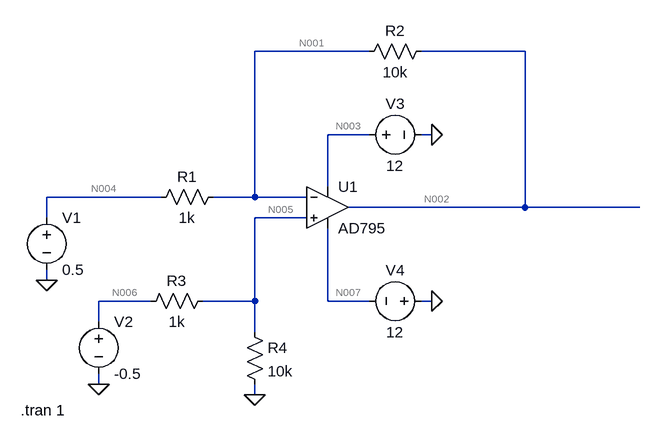
[diagram p0: schematic t1.asc]
t1.asc, the LTspice schematic file:
Version 4.1
SHEET 1 1064 680
WIRE 576 80 400 80
WIRE 816 80 656 80
WIRE 576 208 512 208
WIRE 672 208 656 208
WIRE 512 288 512 208
WIRE 256 304 80 304
WIRE 400 304 400 80
WIRE 400 304 336 304
WIRE 480 304 400 304
WIRE 816 320 816 80
WIRE 816 320 544 320
WIRE 992 320 816 320
WIRE 80 336 80 304
WIRE 480 336 400 336
WIRE 80 432 80 416
WIRE 240 464 160 464
WIRE 400 464 400 336
WIRE 400 464 320 464
WIRE 512 464 512 352
WIRE 576 464 512 464
WIRE 672 464 656 464
WIRE 160 496 160 464
WIRE 400 512 400 464
WIRE 160 592 160 576
WIRE 400 608 400 592
FLAG 80 432 0
FLAG 160 592 0
FLAG 400 608 0
FLAG 672 208 0
FLAG 672 464 0
DATAFLAG 912 320 ""
SYMBOL OpAmps\\AD795 512 256 R0
SYMATTR InstName U1
SYMBOL res 352 288 R90
WINDOW 0 0 56 VBottom 2
WINDOW 3 32 56 VTop 2
SYMATTR InstName R1
SYMATTR Value 1k
SYMBOL res 672 64 R90
WINDOW 0 0 56 VBottom 2
WINDOW 3 32 56 VTop 2
SYMATTR InstName R2
SYMATTR Value 10k
SYMBOL res 336 448 R90
WINDOW 0 0 56 VBottom 2
WINDOW 3 32 56 VTop 2
SYMATTR InstName R3
SYMATTR Value 1k
SYMBOL res 384 496 R0
SYMATTR InstName R4
SYMATTR Value 10k
SYMBOL voltage 80 320 R0
WINDOW 123 0 0 Left 0
WINDOW 39 0 0 Left 0
SYMATTR InstName V1
SYMATTR Value 0.5
SYMBOL voltage 160 480 R0
WINDOW 123 0 0 Left 0
WINDOW 39 0 0 Left 0
SYMATTR InstName V2
SYMATTR Value -0.5
SYMBOL voltage 560 208 R270
WINDOW 0 32 56 VTop 2
WINDOW 3 -32 56 VBottom 2
WINDOW 123 0 0 Left 0
WINDOW 39 0 0 Left 0
SYMATTR InstName V3
SYMATTR Value 12
SYMBOL voltage 672 464 R90
WINDOW 0 -32 56 VBottom 2
WINDOW 3 32 56 VTop 2
WINDOW 123 0 0 Left 0
WINDOW 39 0 0 Left 0
SYMATTR InstName V4
SYMATTR Value 12
TEXT 40 632 Left 2 !.tran 1

The netlist it stands for:
* t1.asc
X§U1 N005 N001 N003 N007 N002 AD795  ; pins In+ In- V+ V- OUT
R1 N001 N004 1k
R2 N002 N001 10k
R3 N005 N006 1k
R4 N005 0 10k
V1 N004 0 0.5
V2 N006 0 -0.5
V3 N003 0 12
V4 0 N007 12
.tran 1
.lib ADI1.lib
.backanno
.end

* Results of the author's LTspice run, read from the files saved beside the schematic
* Operating Point, zero values left out:
*   V(n001) = -380.1 mV
*   V(n002) = -9.181 V
*   V(n003) = 12 V
*   V(n004) = 500 mV
*   V(n005) = -454.5 mV
*   V(n006) = -500 mV
*   V(n007) = -12 V
*   I(R1) = -880.1 µA
*   I(R2) = -880.1 µA
*   I(R3) = 45.45 µA
*   I(R4) = -45.45 µA
*   I(V1) = -880.1 µA
*   I(V2) = 45.45 µA
*   I(V3) = -1.024 mA
*   I(V4) = -1.902 mA
*   Ix(u1:3) = 1.024 mA
*   Ix(u1:4) = -1.902 mA
*   Ix(u1:5) = 880.1 µA